# Altium project KeyBoard.PrjPcb
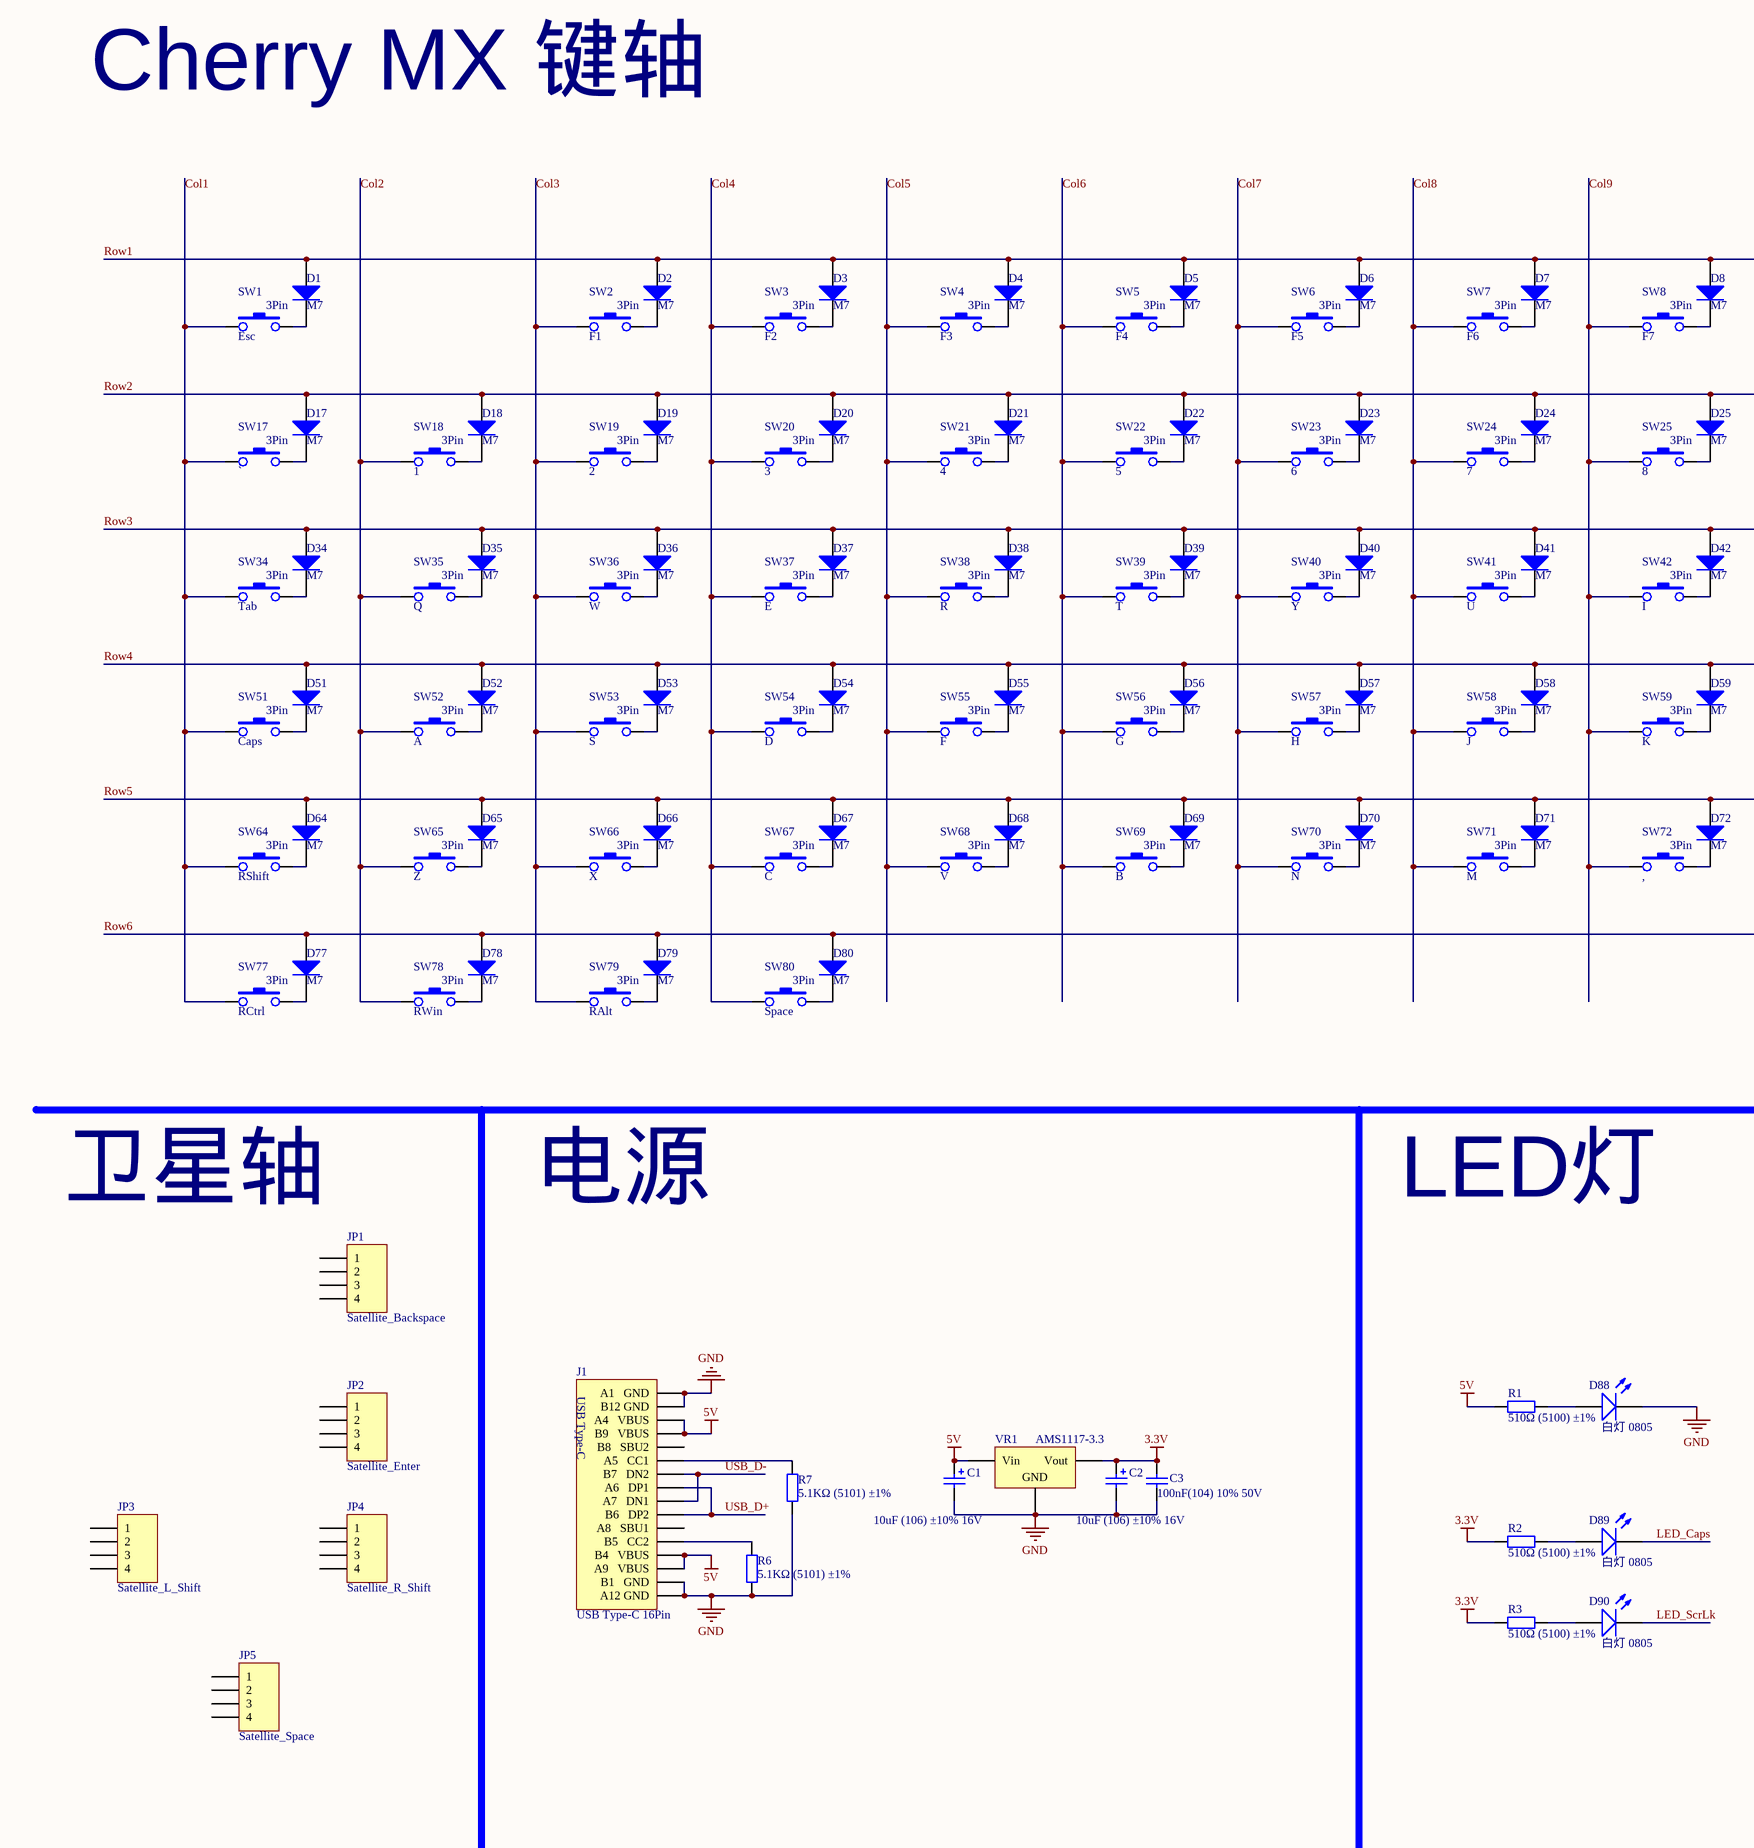
[diagram p0: KeyBoard.SchDoc, left]
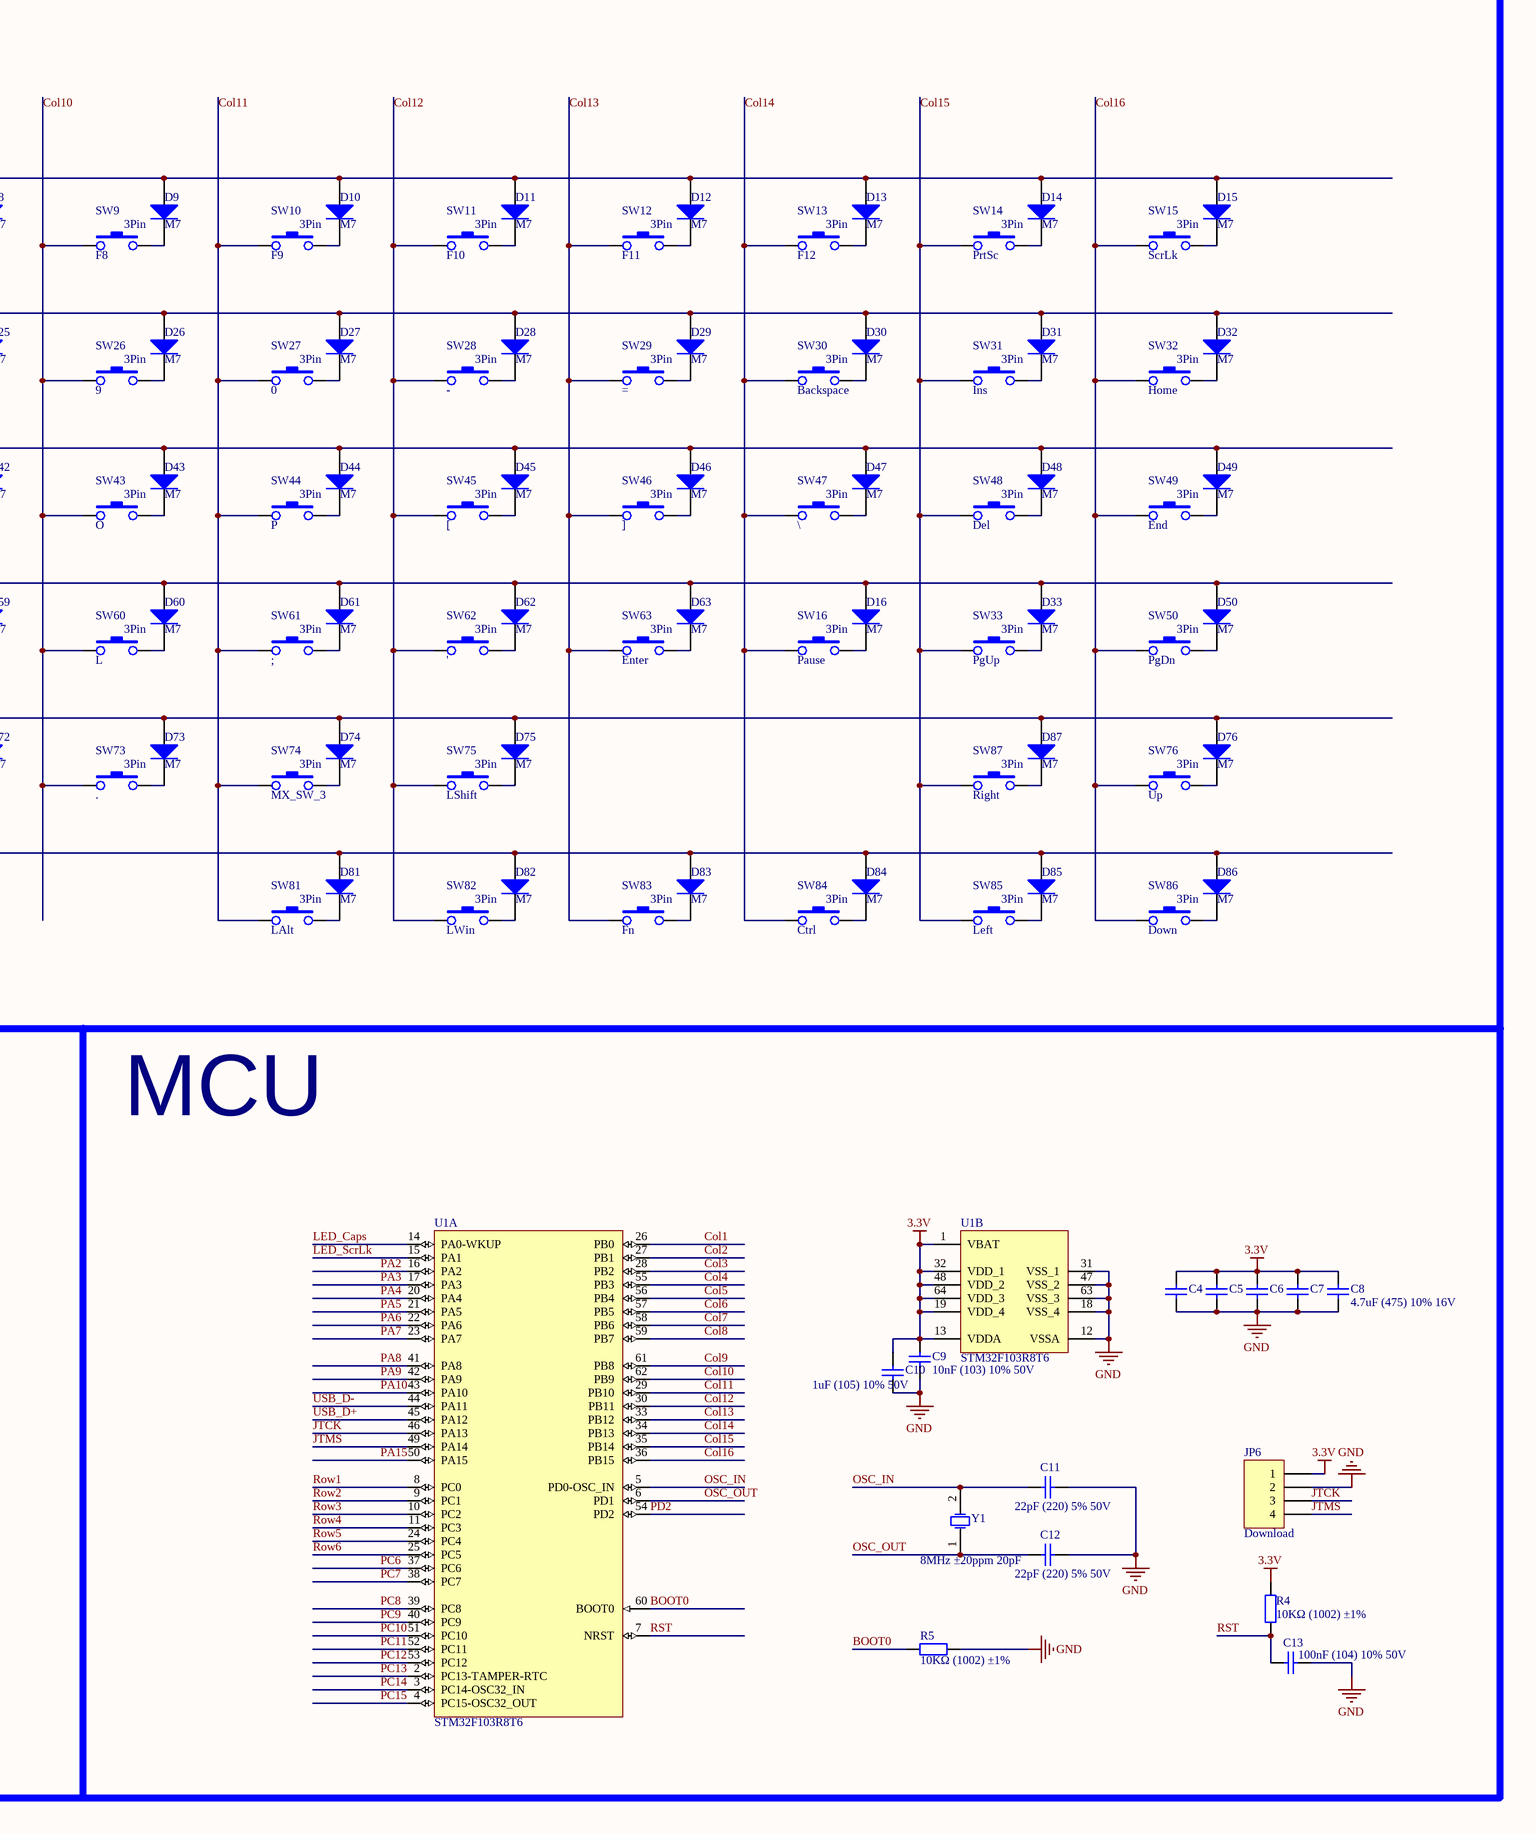
[diagram p1: KeyBoard.SchDoc, right]
1 sheet, 207 parts. Net scope: global (net labels, ports and power ports of the same name join across sheets).
Board file: KeyBoard.PcbDoc

## Sheet KeyBoard.SchDoc
size A1

### Parts
C1  10uF (106) ±10% 16V  [CASE-A_3216]
C2  10uF (106) ±10% 16V  [CASE-A_3216]
C3  100nF(104) 10% 50V  [0805_C]
C4  100nF (104) 10% 50V  [0603_C]  (value not drawn)
C5  100nF (104) 10% 50V  [0603_C]  (value not drawn)
C6  100nF (104) 10% 50V  [0603_C]  (value not drawn)
C7  100nF (104) 10% 50V  [0603_C]  (value not drawn)
C8  4.7uF (475) 10% 16V  [0603_C]
C9  10nF (103) 10% 50V  [0603_C]
C10  1uF (105) 10% 50V  [0603_C]
C11  22pF (220) 5% 50V  [0603_C]
C12  22pF (220) 5% 50V  [0603_C]
C13  100nF (104) 10% 50V  [0603_C]
D1  M7  [SMA(DO-214AC)_S1]
D2  M7  [SMA(DO-214AC)_S1]
D3  M7  [SMA(DO-214AC)_S1]
D4  M7  [SMA(DO-214AC)_S1]
D5  M7  [SMA(DO-214AC)_S1]
D6  M7  [SMA(DO-214AC)_S1]
D7  M7  [SMA(DO-214AC)_S1]
D8  M7  [SMA(DO-214AC)_S1]
D9  M7  [SMA(DO-214AC)_S1]
D10  M7  [SMA(DO-214AC)_S1]
D11  M7  [SMA(DO-214AC)_S1]
D12  M7  [SMA(DO-214AC)_S1]
D13  M7  [SMA(DO-214AC)_S1]
D14  M7  [SMA(DO-214AC)_S1]
D15  M7  [SMA(DO-214AC)_S1]
D16  M7  [SMA(DO-214AC)_S1]
D17  M7  [SMA(DO-214AC)_S1]
D18  M7  [SMA(DO-214AC)_S1]
D19  M7  [SMA(DO-214AC)_S1]
D20  M7  [SMA(DO-214AC)_S1]
D21  M7  [SMA(DO-214AC)_S1]
D22  M7  [SMA(DO-214AC)_S1]
D23  M7  [SMA(DO-214AC)_S1]
D24  M7  [SMA(DO-214AC)_S1]
D25  M7  [SMA(DO-214AC)_S1]
D26  M7  [SMA(DO-214AC)_S1]
D27  M7  [SMA(DO-214AC)_S1]
D28  M7  [SMA(DO-214AC)_S1]
D29  M7  [SMA(DO-214AC)_S1]
D30  M7  [SMA(DO-214AC)_S1]
D31  M7  [SMA(DO-214AC)_S1]
D32  M7  [SMA(DO-214AC)_S1]
D33  M7  [SMA(DO-214AC)_S1]
D34  M7  [SMA(DO-214AC)_S1]
D35  M7  [SMA(DO-214AC)_S1]
D36  M7  [SMA(DO-214AC)_S1]
D37  M7  [SMA(DO-214AC)_S1]
D38  M7  [SMA(DO-214AC)_S1]
D39  M7  [SMA(DO-214AC)_S1]
D40  M7  [SMA(DO-214AC)_S1]
D41  M7  [SMA(DO-214AC)_S1]
D42  M7  [SMA(DO-214AC)_S1]
D43  M7  [SMA(DO-214AC)_S1]
D44  M7  [SMA(DO-214AC)_S1]
D45  M7  [SMA(DO-214AC)_S1]
D46  M7  [SMA(DO-214AC)_S1]
D47  M7  [SMA(DO-214AC)_S1]
D48  M7  [SMA(DO-214AC)_S1]
D49  M7  [SMA(DO-214AC)_S1]
D50  M7  [SMA(DO-214AC)_S1]
D51  M7  [SMA(DO-214AC)_S1]
D52  M7  [SMA(DO-214AC)_S1]
D53  M7  [SMA(DO-214AC)_S1]
D54  M7  [SMA(DO-214AC)_S1]
D55  M7  [SMA(DO-214AC)_S1]
D56  M7  [SMA(DO-214AC)_S1]
D57  M7  [SMA(DO-214AC)_S1]
D58  M7  [SMA(DO-214AC)_S1]
D59  M7  [SMA(DO-214AC)_S1]
D60  M7  [SMA(DO-214AC)_S1]
D61  M7  [SMA(DO-214AC)_S1]
D62  M7  [SMA(DO-214AC)_S1]
D63  M7  [SMA(DO-214AC)_S1]
D64  M7  [SMA(DO-214AC)_S1]
D65  M7  [SMA(DO-214AC)_S1]
D66  M7  [SMA(DO-214AC)_S1]
D67  M7  [SMA(DO-214AC)_S1]
D68  M7  [SMA(DO-214AC)_S1]
D69  M7  [SMA(DO-214AC)_S1]
D70  M7  [SMA(DO-214AC)_S1]
D71  M7  [SMA(DO-214AC)_S1]
D72  M7  [SMA(DO-214AC)_S1]
D73  M7  [SMA(DO-214AC)_S1]
D74  M7  [SMA(DO-214AC)_S1]
D75  M7  [SMA(DO-214AC)_S1]
D76  M7  [SMA(DO-214AC)_S1]
D77  M7  [SMA(DO-214AC)_S1]
D78  M7  [SMA(DO-214AC)_S1]
D79  M7  [SMA(DO-214AC)_S1]
D80  M7  [SMA(DO-214AC)_S1]
D81  M7  [SMA(DO-214AC)_S1]
D82  M7  [SMA(DO-214AC)_S1]
D83  M7  [SMA(DO-214AC)_S1]
D84  M7  [SMA(DO-214AC)_S1]
D85  M7  [SMA(DO-214AC)_S1]
D86  M7  [SMA(DO-214AC)_S1]
D87  M7  [SMA(DO-214AC)_S1]
D88  白灯 0805  [0805_LED_S1]
D89  白灯 0805  [0805_LED_S1]
D90  白灯 0805  [0805_LED_S1]
J1  USB Type-C 16Pin  [USB Type-C 16Pin]
JP1  Satellite_Backspace  [1x2]
JP2  Satellite_Enter  [1x2]
JP3  Satellite_L_Shift  [1x2]
JP4  Satellite_R_Shift  [1x2]
JP5  Satellite_Space  [1x6.25]
JP6  Download  [HDR1X4]
R1  510Ω (5100) ±1%  [0805_R]
R2  510Ω (5100) ±1%  [0805_R]
R3  510Ω (5100) ±1%  [0805_R]
R4  10KΩ (1002) ±1%  [0603_R]
R5  10KΩ (1002) ±1%  [0603_R]
R6  5.1KΩ (5101) ±1%  [0805_R]
R7  5.1KΩ (5101) ±1%  [0805_R]
SW1  Esc  [MX_SW_3]
SW2  F1  [MX_SW_3]
SW3  F2  [MX_SW_3]
SW4  F3  [MX_SW_3]
SW5  F4  [MX_SW_3]
SW6  F5  [MX_SW_3]
SW7  F6  [MX_SW_3]
SW8  F7  [MX_SW_3]
SW9  F8  [MX_SW_3]
SW10  F9  [MX_SW_3]
SW11  F10  [MX_SW_3]
SW12  F11  [MX_SW_3]
SW13  F12  [MX_SW_3]
SW14  PrtSc  [MX_SW_3]
SW15  ScrLk  [MX_SW_3]
SW16  Pause  [MX_SW_3]
SW17  `  [MX_SW_3]
SW18  1  [MX_SW_3]
SW19  2  [MX_SW_3]
SW20  3  [MX_SW_3]
SW21  4  [MX_SW_3]
SW22  5  [MX_SW_3]
SW23  6  [MX_SW_3]
SW24  7  [MX_SW_3]
SW25  8  [MX_SW_3]
SW26  9  [MX_SW_3]
SW27  0  [MX_SW_3]
SW28  -  [MX_SW_3]
SW29  (no value)  [MX_SW_3]
SW30  Backspace  [MX_SW_3]
SW31  Ins  [MX_SW_3]
SW32  Home  [MX_SW_3]
SW33  PgUp  [MX_SW_3]
SW34  Tab  [MX_SW_3]
SW35  Q  [MX_SW_3]
SW36  W  [MX_SW_3]
SW37  E  [MX_SW_3]
SW38  R  [MX_SW_3]
SW39  T  [MX_SW_3]
SW40  Y  [MX_SW_3]
SW41  U  [MX_SW_3]
SW42  I  [MX_SW_3]
SW43  O  [MX_SW_3]
SW44  P  [MX_SW_3]
SW45  [  [MX_SW_3]
SW46  ]  [MX_SW_3]
SW47  \  [MX_SW_3]
SW48  Del  [MX_SW_3]
SW49  End  [MX_SW_3]
SW50  PgDn  [MX_SW_3]
SW51  Caps  [MX_SW_3]
SW52  A  [MX_SW_3]
SW53  S  [MX_SW_3]
SW54  D  [MX_SW_3]
SW55  F  [MX_SW_3]
SW56  G  [MX_SW_3]
SW57  H  [MX_SW_3]
SW58  J  [MX_SW_3]
SW59  K  [MX_SW_3]
SW60  L  [MX_SW_3]
SW61  ;  [MX_SW_3]
SW62  '  [MX_SW_3]
SW63  Enter  [MX_SW_3]
SW64  RShift  [MX_SW_3]
SW65  Z  [MX_SW_3]
SW66  X  [MX_SW_3]
SW67  C  [MX_SW_3]
SW68  V  [MX_SW_3]
SW69  B  [MX_SW_3]
SW70  N  [MX_SW_3]
SW71  M  [MX_SW_3]
SW72  ,  [MX_SW_3]
SW73  .  [MX_SW_3]
SW74  MX_SW_3  [MX_SW_3]
SW75  LShift  [MX_SW_3]
SW76  Up  [MX_SW_3]
SW77  RCtrl  [MX_SW_3]
SW78  RWin  [MX_SW_3]
SW79  RAlt  [MX_SW_3]
SW80  Space  [MX_SW_3]
SW81  LAlt  [MX_SW_3]
SW82  LWin  [MX_SW_3]
SW83  Fn  [MX_SW_3]
SW84  Ctrl  [MX_SW_3]
SW85  Left  [MX_SW_3]
SW86  Down  [MX_SW_3]
SW87  Right  [MX_SW_3]
U1  STM32F103R8T6  [LQFP-64_10x10x05P]  (parts A,B of 2)
VR1  AMS1117-3.3  [SOT-223]
Y1  8MHz ±20ppm 20pF  [SMD-5032_2P]

### Nets
3.3V: C2.1 C3.2 C4.2 C5.2 C6.2 C7.2 C8.2 C9.2 C10.2 JP6.1 R2.1 R3.1 R4.2 U1.1(VBAT) U1.13(VDDA) U1.19(VDD_4) U1.32(VDD_1) U1.48(VDD_2) U1.64(VDD_3) VR1.2(Vout)
5V: C1.1 J1.2(A4___VBUS) J1.11(B4___VBUS) R1.1 VR1.3(Vin)
GND: C1.2 C2.2 C3.1 C4.1 C5.1 C6.1 C7.1 C8.1 C9.1 C10.1 C11.2 C12.2 C13.2 D88.K J1.1(A1___GND) J1.12(B1___GND) JP6.2 R5.2 R6.1 R7.1 U1.12(VSSA) U1.18(VSS_4) U1.31(VSS_1) U1.47(VSS_2) U1.63(VSS_3) VR1.1(GND)
BOOT0: R5.1 U1.60(BOOT0)
Col1: SW1.1 SW17.1 SW34.1 SW51.1 SW64.1 SW77.1 U1.26(PB0)
Col2: SW18.1 SW35.1 SW52.1 SW65.1 SW78.1 U1.27(PB1)
Col3: SW2.1 SW19.1 SW36.1 SW53.1 SW66.1 SW79.1 U1.28(PB2)
Col4: SW3.1 SW20.1 SW37.1 SW54.1 SW67.1 SW80.1 U1.55(PB3)
Col5: SW4.1 SW21.1 SW38.1 SW55.1 SW68.1 U1.56(PB4)
Col6: SW5.1 SW22.1 SW39.1 SW56.1 SW69.1 U1.57(PB5)
Col7: SW6.1 SW23.1 SW40.1 SW57.1 SW70.1 U1.58(PB6)
Col8: SW7.1 SW24.1 SW41.1 SW58.1 SW71.1 U1.59(PB7)
Col9: SW8.1 SW25.1 SW42.1 SW59.1 SW72.1 U1.61(PB8)
Col10: SW9.1 SW26.1 SW43.1 SW60.1 SW73.1 U1.62(PB9)
Col11: SW10.1 SW27.1 SW44.1 SW61.1 SW74.1 SW81.1 U1.29(PB10)
Col12: SW11.1 SW28.1 SW45.1 SW62.1 SW75.1 SW82.1 U1.30(PB11)
Col13: SW12.1 SW29.1 SW46.1 SW63.1 SW83.1 U1.33(PB12)
Col14: SW13.1 SW16.1 SW30.1 SW47.1 SW84.1 U1.34(PB13)
Col15: SW14.1 SW31.1 SW33.1 SW48.1 SW85.1 SW87.1 U1.35(PB14)
Col16: SW15.1 SW32.1 SW49.1 SW50.1 SW76.1 SW86.1 U1.36(PB15)
JTCK: JP6.3 U1.46(PA13)
JTMS: JP6.4 U1.49(PA14)
LED_Caps: D89.K U1.14(PA0-WKUP)
LED_ScrLk: D90.K U1.15(PA1)
OSC_IN: C11.1 U1.5(PD0-OSC_IN) Y1.2(OSC2)
OSC_OUT: C12.1 U1.6(PD1) Y1.1(OSC1)
PA2: U1.16(PA2)
PA3: U1.17(PA3)
PA4: U1.20(PA4)
PA5: U1.21(PA5)
PA6: U1.22(PA6)
PA7: U1.23(PA7)
PA8: U1.41(PA8)
PA9: U1.42(PA9)
PA10: U1.43(PA10)
PA15: U1.50(PA15)
PC6: U1.37(PC6)
PC7: U1.38(PC7)
PC8: U1.39(PC8)
PC9: U1.40(PC9)
PC10: U1.51(PC10)
PC11: U1.52(PC11)
PC12: U1.53(PC12)
PC13: U1.2(PC13-TAMPER-RTC)
PC14: U1.3(PC14-OSC32_IN)
PC15: U1.4(PC15-OSC32_OUT)
PD2: U1.54(PD2)
Row1: D1.1(A) D2.1(A) D3.1(A) D4.1(A) D5.1(A) D6.1(A) D7.1(A) D8.1(A) D9.1(A) D10.1(A) D11.1(A) D12.1(A) D13.1(A) D14.1(A) D15.1(A) U1.8(PC0)
Row2: D17.1(A) D18.1(A) D19.1(A) D20.1(A) D21.1(A) D22.1(A) D23.1(A) D24.1(A) D25.1(A) D26.1(A) D27.1(A) D28.1(A) D29.1(A) D30.1(A) D31.1(A) D32.1(A) U1.9(PC1)
Row3: D34.1(A) D35.1(A) D36.1(A) D37.1(A) D38.1(A) D39.1(A) D40.1(A) D41.1(A) D42.1(A) D43.1(A) D44.1(A) D45.1(A) D46.1(A) D47.1(A) D48.1(A) D49.1(A) U1.10(PC2)
Row4: D16.1(A) D33.1(A) D50.1(A) D51.1(A) D52.1(A) D53.1(A) D54.1(A) D55.1(A) D56.1(A) D57.1(A) D58.1(A) D59.1(A) D60.1(A) D61.1(A) D62.1(A) D63.1(A) U1.11(PC3)
Row5: D64.1(A) D65.1(A) D66.1(A) D67.1(A) D68.1(A) D69.1(A) D70.1(A) D71.1(A) D72.1(A) D73.1(A) D74.1(A) D75.1(A) D76.1(A) D87.1(A) U1.24(PC4)
Row6: D77.1(A) D78.1(A) D79.1(A) D80.1(A) D81.1(A) D82.1(A) D83.1(A) D84.1(A) D85.1(A) D86.1(A) U1.25(PC5)
RST: C13.1 R4.1 U1.7(NRST)
USB_D+: J1.6(A6___DP1) J1.8(B6___DP2) U1.45(PA12)
USB_D-: J1.5(B7___DN2) J1.7(A7___DN1) U1.44(PA11)
NetD1_2: D1.2(K) SW1.2
NetD2_2: D2.2(K) SW2.2
NetD3_2: D3.2(K) SW3.2
NetD4_2: D4.2(K) SW4.2
NetD5_2: D5.2(K) SW5.2
NetD6_2: D6.2(K) SW6.2
NetD7_2: D7.2(K) SW7.2
NetD8_2: D8.2(K) SW8.2
NetD9_2: D9.2(K) SW9.2
NetD10_2: D10.2(K) SW10.2
NetD11_2: D11.2(K) SW11.2
NetD12_2: D12.2(K) SW12.2
NetD13_2: D13.2(K) SW13.2
NetD14_2: D14.2(K) SW14.2
NetD15_2: D15.2(K) SW15.2
NetD16_2: D16.2(K) SW16.2
NetD17_2: D17.2(K) SW17.2
NetD18_2: D18.2(K) SW18.2
NetD19_2: D19.2(K) SW19.2
NetD20_2: D20.2(K) SW20.2
NetD21_2: D21.2(K) SW21.2
NetD22_2: D22.2(K) SW22.2
NetD23_2: D23.2(K) SW23.2
NetD24_2: D24.2(K) SW24.2
NetD25_2: D25.2(K) SW25.2
NetD26_2: D26.2(K) SW26.2
NetD27_2: D27.2(K) SW27.2
NetD28_2: D28.2(K) SW28.2
NetD29_2: D29.2(K) SW29.2
NetD30_2: D30.2(K) SW30.2
NetD31_2: D31.2(K) SW31.2
NetD32_2: D32.2(K) SW32.2
NetD33_2: D33.2(K) SW33.2
NetD34_2: D34.2(K) SW34.2
NetD35_2: D35.2(K) SW35.2
NetD36_2: D36.2(K) SW36.2
NetD37_2: D37.2(K) SW37.2
NetD38_2: D38.2(K) SW38.2
NetD39_2: D39.2(K) SW39.2
NetD40_2: D40.2(K) SW40.2
NetD41_2: D41.2(K) SW41.2
NetD42_2: D42.2(K) SW42.2
NetD43_2: D43.2(K) SW43.2
NetD44_2: D44.2(K) SW44.2
NetD45_2: D45.2(K) SW45.2
NetD46_2: D46.2(K) SW46.2
NetD47_2: D47.2(K) SW47.2
NetD48_2: D48.2(K) SW48.2
NetD49_2: D49.2(K) SW49.2
NetD50_2: D50.2(K) SW50.2
NetD51_2: D51.2(K) SW51.2
NetD52_2: D52.2(K) SW52.2
NetD53_2: D53.2(K) SW53.2
NetD54_2: D54.2(K) SW54.2
NetD55_2: D55.2(K) SW55.2
NetD56_2: D56.2(K) SW56.2
NetD57_2: D57.2(K) SW57.2
NetD58_2: D58.2(K) SW58.2
NetD59_2: D59.2(K) SW59.2
NetD60_2: D60.2(K) SW60.2
NetD61_2: D61.2(K) SW61.2
NetD62_2: D62.2(K) SW62.2
NetD63_2: D63.2(K) SW63.2
NetD64_2: D64.2(K) SW64.2
NetD65_2: D65.2(K) SW65.2
NetD66_2: D66.2(K) SW66.2
NetD67_2: D67.2(K) SW67.2
NetD68_2: D68.2(K) SW68.2
NetD69_2: D69.2(K) SW69.2
NetD70_2: D70.2(K) SW70.2
NetD71_2: D71.2(K) SW71.2
NetD72_2: D72.2(K) SW72.2
NetD73_2: D73.2(K) SW73.2
NetD74_2: D74.2(K) SW74.2
NetD75_2: D75.2(K) SW75.2
NetD76_2: D76.2(K) SW76.2
NetD77_2: D77.2(K) SW77.2
NetD78_2: D78.2(K) SW78.2
NetD79_2: D79.2(K) SW79.2
NetD80_2: D80.2(K) SW80.2
NetD81_2: D81.2(K) SW81.2
NetD82_2: D82.2(K) SW82.2
NetD83_2: D83.2(K) SW83.2
NetD84_2: D84.2(K) SW84.2
NetD85_2: D85.2(K) SW85.2
NetD86_2: D86.2(K) SW86.2
NetD87_2: D87.2(K) SW87.2
NetD88_A: D88.A R1.2
NetD89_A: D89.A R2.2
NetD90_A: D90.A R3.2
NetJ1_4: J1.4(A5___CC1) R7.2
NetJ1_10: J1.10(B5___CC2) R6.2

Not connected (* = marked no-connect by the designer): J1 3(B8___SBU2) 9(A8___SBU1); JP1 1 2 3 4; JP2 1 2 3 4; JP3 1 2 3 4; JP4 1 2 3 4; JP5 1 2 3 4

### Notes on the sheet
- Cherry MX 键轴
- 卫星轴
- 电源
- LED灯
- MCU
- (in symbol MX_SW_3) 3Pin
- (in symbol USB Type-C 16Pin) USB Type-C

### Library data of the parts
C1 C2 = 3216 10uF (106) 10% 16V: 钽电容; ComponentLink1Description: 供应商链接; ComponentLink1URL: http://www.szlcsc.com/product/details_7643.html; Package: 3216; Supplier: LC; SuppliersPartNumber: C7171
C3 = 0805 100nF(104) 10% 50V: 贴片电容; ComponentLink1Description: 供应商链接; ComponentLink1URL: http://www.szlcsc.com/product/details_50686.html; Package: 0805; Supplier: LC; SuppliersPartNumber: C49678
C4-C7 C13 = 0603 100nF (104) 10% 50V: 贴片电容; ComponentLink1Description: 供应商链接; ComponentLink1URL: http://www.szlcsc.com/product/details_15331.html; Package: 0603; Supplier: LC; SuppliersPartNumber: C14663
C8 = 0603 4.7uF (475) 10% 16V: 贴片电容; ComponentLink1Description: 供应商链接; ComponentLink1URL: http://www.szlcsc.com/product/details_20375.html; Package: 0603; Supplier: LC; SuppliersPartNumber: C19666
C9 = 0603 10nF (103) 10% 50V: 贴片电容; ComponentLink1Description: 供应商链接; ComponentLink1URL: http://www.szlcsc.com/product/details_58143.html; Package: 0603; Supplier: LC; SuppliersPartNumber: C57112
C10 = 0603 1uF (105) 10% 50V: 贴片电容; ComponentLink1Description: 供应商链接; ComponentLink1URL: http://www.szlcsc.com/product/details_16531.html; Package: 0603; Supplier: LC; SuppliersPartNumber: C15849
C11 C12 = 0603 22pF (220) 5% 50V: 贴片电容; ComponentLink1Description: 供应商链接; ComponentLink1URL: http://www.szlcsc.com/product/details_2005.html; Package: 0603; Supplier: LC; SuppliersPartNumber: C1653
D1-D87 = SMA(DO-214AC) M7: 二极管; Notepad: 1N4007 4007 编号C2464 已经停售, 使用新物料编号C95872; ComponentLink1Description: 供应商链接; ComponentLink1URL: http://www.szlcsc.com/product/details_2841.html; Package: SMA(DO-214AC); Supplier: LC; SuppliersPartNumber: C95872
D88-D90 = 0805 白灯: 发光二极管; ComponentLink1Description: 供应商链接; ComponentLink1URL: http://www.szlcsc.com/product/details_35468.html; Package: 0805; Supplier: LC; SuppliersPartNumber: C34499
JP1-JP6 = Header 4: Header, 4-Pin; LatestRevisionDate: 17-Jul-2002; LatestRevisionNote: Re-released for DXP Platform.; Publisher: Altium Limited
R1-R3 = 0805 510Ω (5100) 1%: 贴片电阻; ComponentLink1Description: 供应商链接; ComponentLink1URL: http://www.szlcsc.com/product/details_18422.html; Package: 0805; Supplier: LC; SuppliersPartNumber: C17734
R4 R5 = 0603 10KΩ (1002) 1%: 贴片电阻; ComponentLink1Description: 供应商链接; ComponentLink1URL: http://www.szlcsc.com/product/details_26547.html; Package: 0603; Supplier: LC; SuppliersPartNumber: C25804
R6 R7 = 0805 5.1KΩ (5101) 1%: 贴片电阻; ComponentLink1Description: 供应商链接; ComponentLink1URL: http://www.szlcsc.com/product/details_28584.html; Package: 0805; Supplier: LC; SuppliersPartNumber: C27834
SW1-SW87 = MX_SW_3: without Fixation pins  1-Pole
U1 = STM32F103R8T6: ARM; ComponentLink1Description: 供应商链接; ComponentLink1URL: http://www.szlcsc.com/product/details_47037.html; Package: LQFP-64_10x10x05P; Supplier: LC; SuppliersPartNumber: C46034
VR1 = SOT-223 AMS1117-3.3: 低压差线性稳压(LDO); ComponentLink1Description: 供应商链接; ComponentLink1URL: http://www.szlcsc.com/product/details_6652.html; Package: SOT-223; Supplier: LC; SuppliersPartNumber: C6186
Y1 = SMD-5032_2P 8MHz 20ppm 20pF: 贴片晶振; ComponentLink1Description: 供应商链接; ComponentLink1URL: http://www.szlcsc.com/product/details_117214.html; Package: SMD-5032_2P; Supplier: LC; SuppliersPartNumber: C115962